# EAGLE design kicker2.2 (EAGLE 4.16)
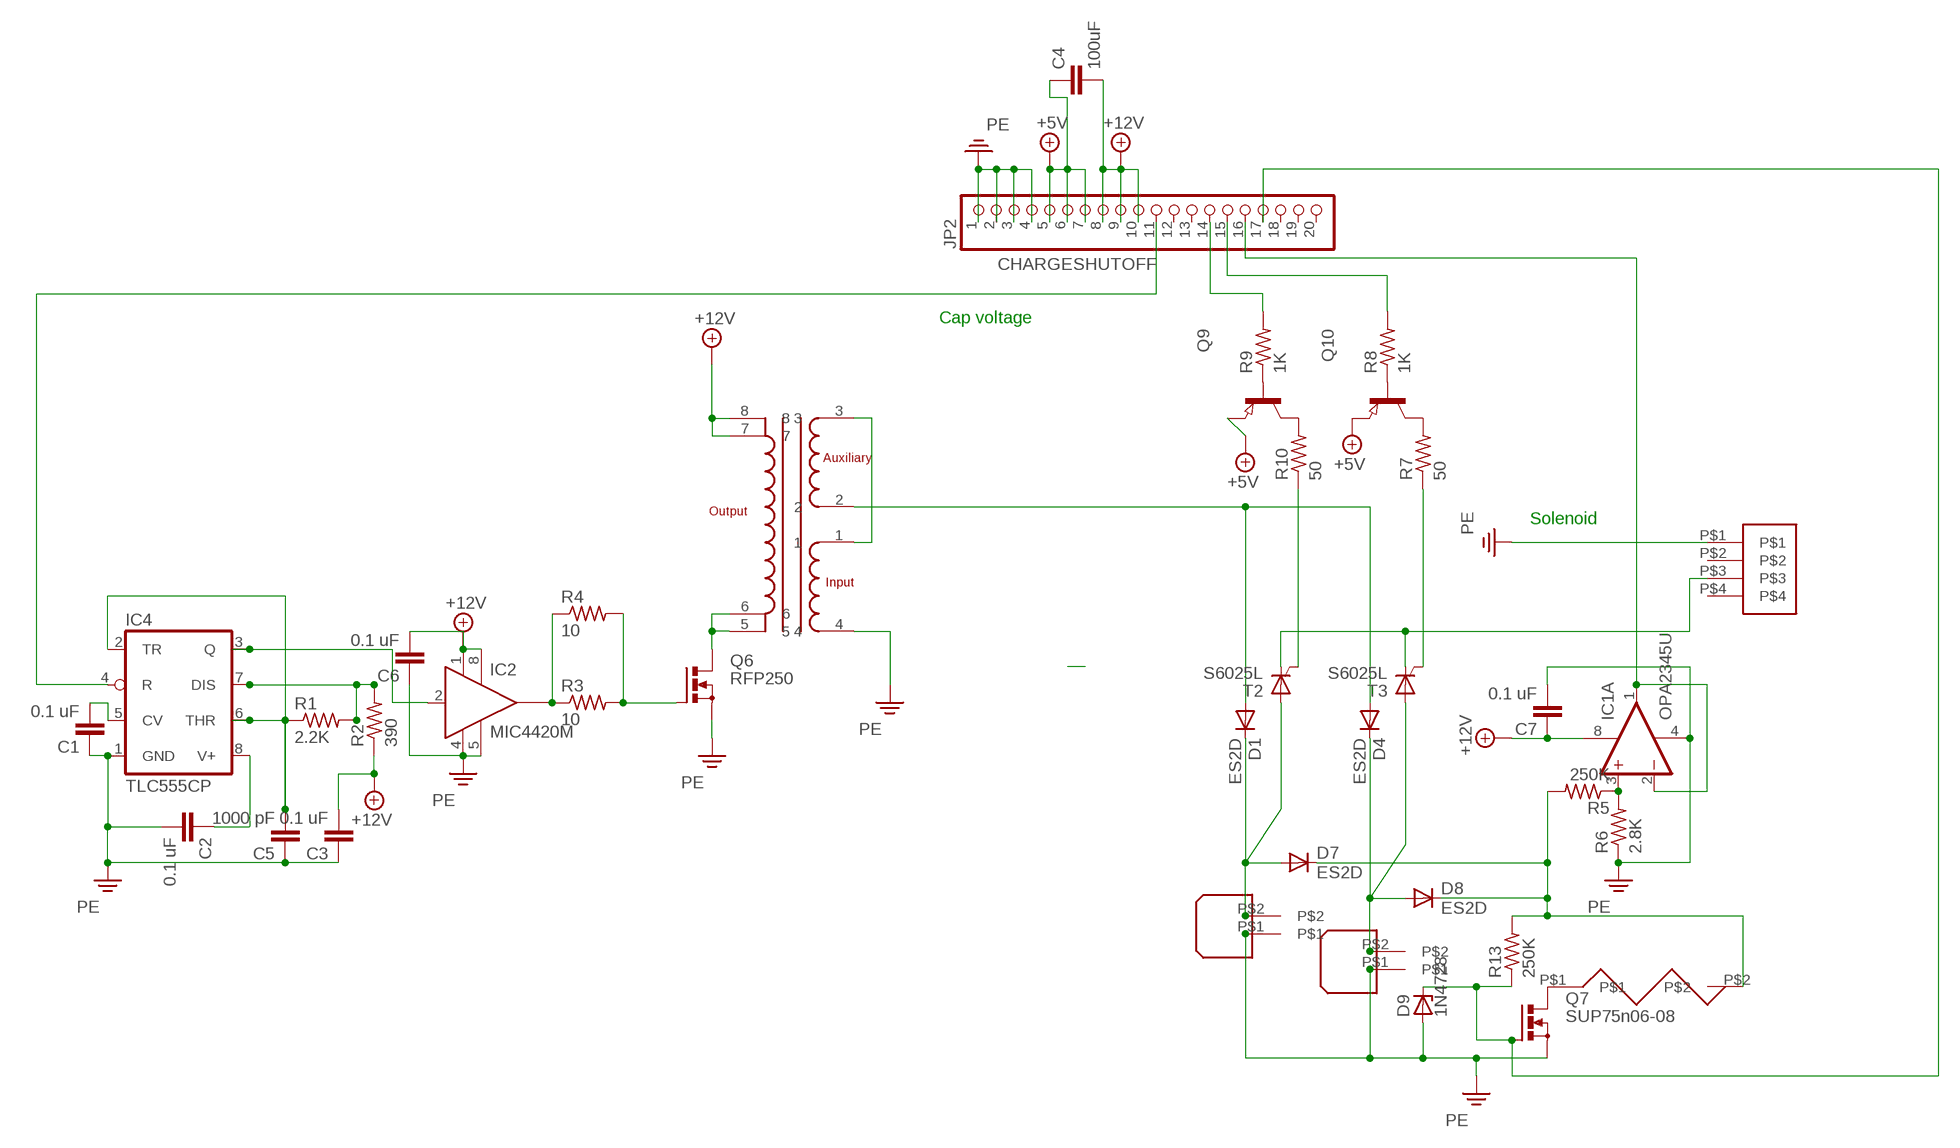
[diagram p0: schematic, sheet 1]

## Parts
C1  0.1 uF  C-EUC0805  [C0805]
C2  0.1 uF  C-EUC0805  [C0805]
C3  0.1 uF  C-EUC0805  [C0805]
C4  100uF  C-EU025-050X050  [C025-050X050]
C5  1000 pF  C-EUC0805  [C0805]
C6  0.1 uF  C-EUC0805  [C0805]
C7  0.1 uF  C-EUC0805  [C0805]
D1  ES2D  [SMB]
D4  ES2D  [SMB]
D7  ES2D  [SMB]
D8  ES2D  [SMB]
D9  1N4728  [DO41Z10]
IC1  OPA2345U  [SO08]
IC2  MIC4420M  [SO-08]
IC4  TLC555CP  LM555D  [SO08]
JP2  PINHD-1X20  [1X20]
Q6  RFP250  IRFP240  [TO247BV]
Q7  SUP75n06-08  PMOSFET_NTO220BV  [TO220BV]
Q9  PNP-TRANSISTOR_SOT23W  [SOT23W]
Q10  PNP-TRANSISTOR_SOT23W  [SOT23W]
R1  2.2K  R-US_R0805  [R0805]
R2  390  R-US_R0805  [R0805]
R3  10  R-US_R0805  [R0805]
R4  10  R-US_R0805  [R0805]
R5  250K  R-US_R0805  [R0805]
R6  2.8K  R-US_R0805  [R0805]
R7  50  R-US_R0805  [R0805]
R8  1K  R-US_R0805  [R0805]
R9  1K  R-US_R0805  [R0805]
R10  50  R-US_R0805  [R0805]
R13  250K  R-US_R0805  [R0805]
T2  S6025L  BTV58  [TO220CS]
T3  S6025L  BTV58  [TO220CS]
U$1  A0009-AL  [SM]
U$4  2PINHEADER  [2007]
U$5  2PINHEADER  [2007]
U$7  RESISTOR  [RESISTOR]
U$8  CONNECT  [CONNECT]

## Nets
+5V: C4.1 JP2.5 JP2.6 JP2.7 Q9.2(E) Q10.2(E)
+12V: C3.2 C4.2 C6.2 C7.1 IC1.8(A:V+) IC2.1(VS) IC2.8(VS1) JP2.8 JP2.9 JP2.10 R2.1 U$1.7 U$1.8
CHARGESHUTOFF: IC4.4(R) JP2.11
N$1: Q6.G R3.2 R4.2
N$2: U$1.1 U$1.3
N$4: IC2.6(OUT) R3.1 R4.1
N$5: Q6.D U$1.5 U$1.6
N$6: D1.A D4.A U$1.2
N$9: D1.C D7.A T2.A U$5.P$2
N$10: D4.C D8.A T3.A U$4.P$2
N$11: D7.C D8.C R5.2 R13.2 U$7.P$2
N$12: Q7.D U$7.P$1
N$13: R7.1 T3.G
N$16: IC1.1(A:OUT) IC1.2(A:-IN) JP2.16
N$17: IC4.7(DIS) R1.2 R2.2
N$18: C1.2 IC4.5(CV)
N$19: C2.1 IC4.8(V+)
N$20: JP2.15 R8.2
N$21: C5.2 IC4.2(TR) IC4.6(THR) R1.1
N$22: JP2.14 R9.2
N$23: IC1.3(A:+IN) R5.1 R6.2
N$24: IC2.2(IN) IC4.3(Q)
N$27: Q9.1(B) R9.1
N$28: Q9.3(C) R10.2
N$29: T2.C T3.C U$8.P$3
N$31: Q10.3(C) R7.2
N$34: Q10.1(B) R8.1
N$35: R10.1 T2.G
N$38: D9.C JP2.17 Q7.G R13.1
PE: C1.1 C2.2 C3.1 C5.1 C6.1 C7.2 D9.A IC1.4(A:V-) IC2.4(GND) IC2.5(GND1) IC4.1(GND) JP2.1 JP2.2 JP2.3 JP2.4 Q6.S Q7.S R6.1 U$1.4 U$4.P$1 U$5.P$1 U$8.P$1
Unconnected: IC1.5(B:+IN) IC1.6(B:-IN) IC1.7(B:OUT) IC2.7(OUT) JP2.12 JP2.13 JP2.18 JP2.19 JP2.20 U$8.P$2 U$8.P$4

## Notes on the sheet
- Cap voltage
- Solenoid

## Library data of the parts
C1-C7 = rcl:C-EU: CAPACITOR, European symbol
D1 D4 D7 D8 = diode:ES2D: DIODE super fast rectifier, 2 A
D9 = diode:1N4728: Z DIODE 3.3 V, 1W, 5 percent
IC1 = linear:OPA2*: Dual Operational Amplifier Low Power, Single-Supply, Rail-To-Rail Operational Amplifier Source: http://focus.ti.com/lit/ds/symlink/opa2345.pdf
IC2 = transistor-power:MIC4420: 6A-Peak Low-Side MOSFET Driver Bipolar/CMOS/DMOS Process http://www.micrel.com/_PDF/mic4420.pdf
IC4 = linear:*555: TIMER
JP2 = pinhead:PINHD-1X20: PIN HEADER
Q6 = transistor-power:IRFP240: HEXFET Power MosFet Source: http://www.irf.com/
Q7 = transistor-power:PMOSFET_N: Power MOSFET N-Channel
Q9 Q10 = semicon-smd-ipc:PNP-TRANSISTOR_: PNP TRANSISTOR
R1-R10 R13 = rcl:R-US_: RESISTOR, American symbol
T2 T3 = triac:BTV58: THYRISTOR
U$1 = Kicker:A0009-AL
U$4 U$5 = kickerHeader:2PINHEADER
U$7 = kickerHeader:RESISTOR
U$8 = 19inch:CONNECT

## Board
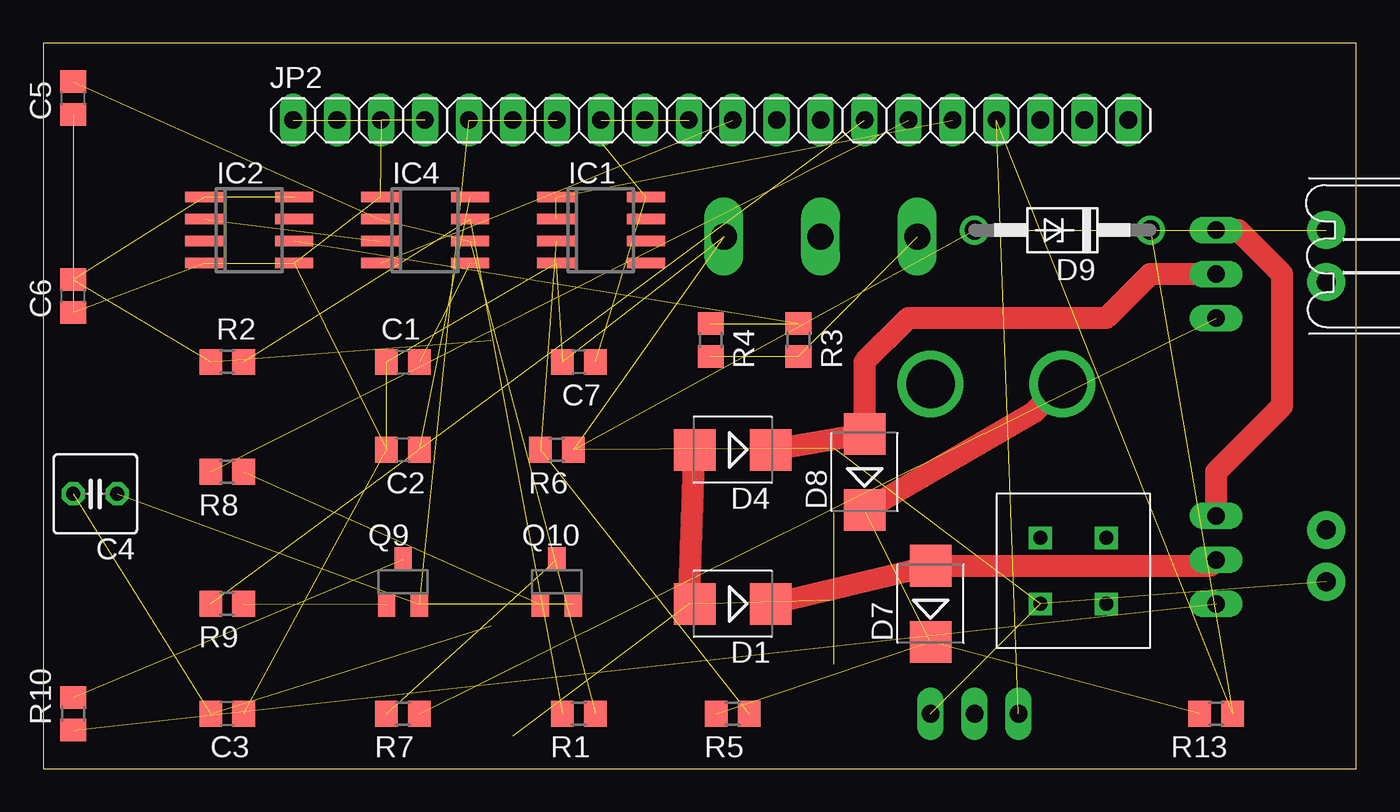
[diagram p1: board, top side]
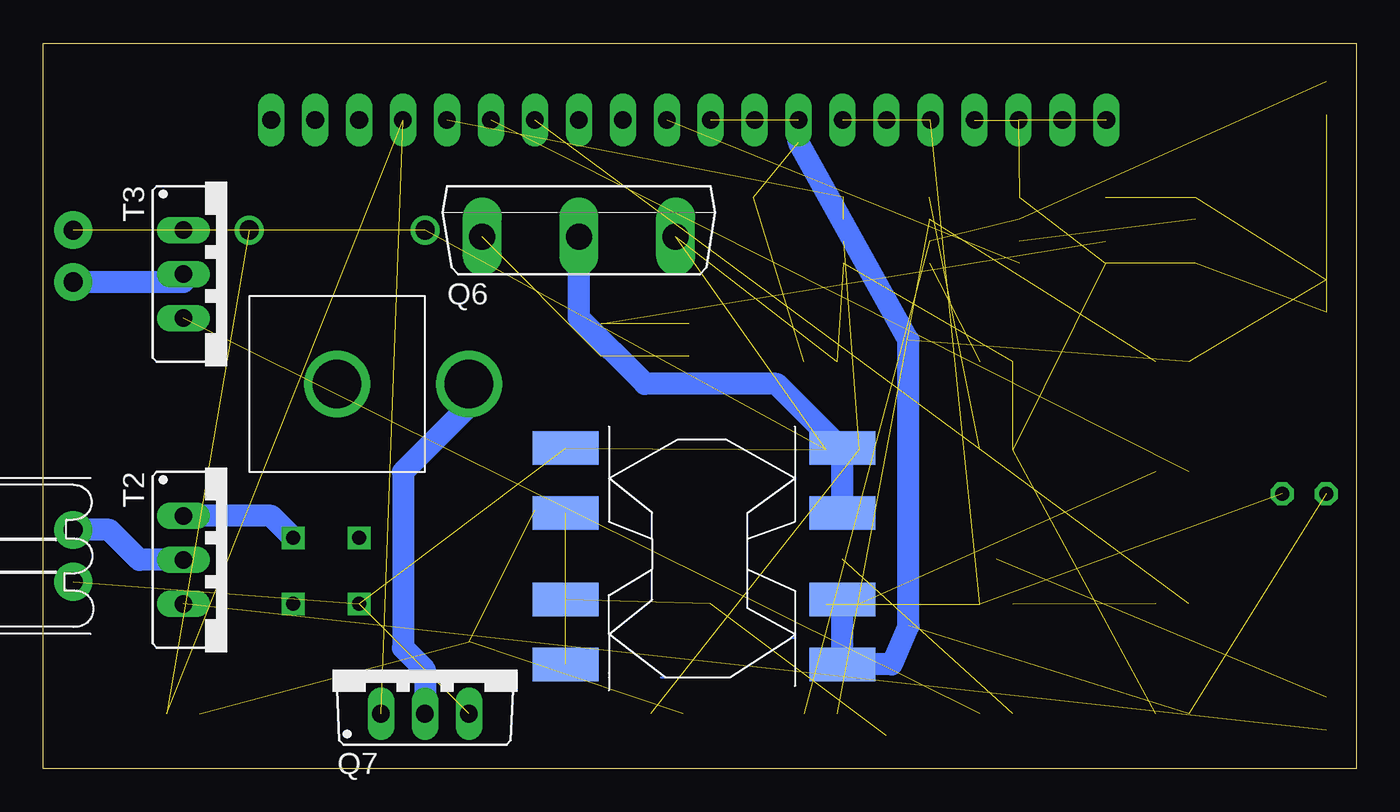
[diagram p2: board, bottom side, seen from below]

Size 75.87 x 41.9 mm. Coordinates in mm from the lower left corner, seen from the top.
Outline: 0,0 75.87,0 75.87,41.9 0,41.9 0,0
Copper layers (1*16): Top 0.035mm / dielectric 1.5mm / Bottom 0.035mm
Design rules "default": minimum track width 10mil, minimum drill 24mil, track to track 8mil, track to pad 8mil, pad to pad 8mil, via to via 8mil, smd to smd 8mil, copper to edge 40mil, drill to drill 8mil, minimum pad ring 10mil, minimum via ring 8mil, stop-mask expansion 4mil, vias tented up to drill 0mil, thermal gap 10mil

### Footprints (pad centres in the part's own frame; a part is rotated, then mirrored left to right if it is on the bottom)
C0805 = smd 1.3 x 1.5: 1 -0.95,0; 2 0.95,0
C025-050X050 = drill 0.813 octagon: 1 -1.27,0; 2 1.27,0
SMB = smd 2.4 x 2.4: A 2.2,0; C -2.2,0
DO41Z10 = drill 1.118 round: A 5.08,0; C -5.08,0
SO08 = smd 0.6 x 2.2: 1 -1.905,-2.6; 2 -0.635,-2.6; 3 0.635,-2.6; 4 1.905,-2.6; 5 1.905,2.6; 6 0.635,2.6; 7 -0.635,2.6; 8 -1.905,2.6
SO-08 = smd 0.6 x 2.2: 1 -1.905,-2.6; 2 -0.635,-2.6; 3 0.635,-2.6; 4 1.905,-2.6; 5 1.905,2.6; 6 0.635,2.6; 7 -0.635,2.6; 8 -1.905,2.6
1X20 = drill 1.016 long: 1 -24.13,0; 2 -21.59,0; 3 -19.05,0; 4 -16.51,0; 5 -13.97,0; 6 -11.43,0; 7 -8.89,0; 8 -6.35,0; 9 -3.81,0; 10 -1.27,0; 11 1.27,0; 12 3.81,0; 13 6.35,0; 14 8.89,0; 15 11.43,0; 16 13.97,0; 17 16.51,0; 18 19.05,0; 19 21.59,0; 20 24.13,0
TO247BV = drill 1.499 long: D 0,-2.921; G -5.588,-2.921; S 5.588,-2.921
TO220BV = drill 1.016 long: D 0,-2.54; G -2.54,-2.54; S 2.54,-2.54
SOT23W = smd 1 x 1.4: 1 -0.95,-1.303; 2 0.95,-1.303; 3 0,1.303
R0805 = smd 1.3 x 1.5: 1 -0.95,0; 2 0.95,0
TO220CS = drill 1.016 long: A 0,-2.54; C -2.54,-2.54; G 2.54,-2.54
SM = smd 3.81 x 1.93: 1 0.5,-3.5; 2 0.5,0.25; 3 0.5,5.25; 4 0.5,9; 5 16.5,9; 6 16.5,5.25; 7 16.5,0.25; 8 16.5,-3.5
2007 = drill 1.1 pad 2.184 round: P$1 0,0; P$2 3,0
RESISTOR = drill 2.8 round: P$1 -2.54,0; P$2 5.08,0
CONNECT = drill 0.8 square: P$1 2.54,2.54; P$2 6.35,2.54; P$3 6.35,6.35; P$4 2.54,6.35

### Placement (x,y rotation side)
C1  20.79,23.49 0 top
C2  20.79,18.41 180 top
C3  10.63,3.17 180 top
C4  3.01,15.87 180 top
C5  1.74,38.73 90 top
C6  1.74,27.3 90 top
C7  30.95,23.49 180 top
D1  39.84,9.52 180 top
D4  39.84,18.41 180 top
D7  51.27,9.52 90 top
D8  47.46,17.14 90 top
D9  58.89,31.11 180 top
IC1  32.22,31.11 270 top
IC2  11.9,31.11 270 top
IC4  22.06,31.11 270 top
JP2  38.57,37.46 0 top
Q6  44.92,33.65 0 bottom
Q7  53.81,5.71 0 bottom
Q9  20.79,10.79 0 top
Q10  29.68,10.79 0 top
R1  30.95,3.17 180 top
R2  10.63,23.49 0 top
R3  43.65,24.76 270 top
R4  38.57,24.76 270 top
R5  39.84,3.17 180 top
R6  29.68,18.41 180 top
R7  20.79,3.17 180 top
R8  10.63,17.14 180 top
R9  10.63,9.52 180 top
R10  1.74,3.17 90 top
R13  67.78,3.17 180 top
T2  65.24,12.06 270 bottom
T3  65.24,28.57 270 bottom
U$1  46.19,9.52 0 bottom
U$4  74.13,31.11 270 top
U$5  74.13,10.79 90 bottom
U$7  53.81,22.22 180 bottom
U$8  55.08,6.98 0 top

### Tracks (layer width: path | path; a pad name or v marks a point on that pad's centre or on a via)
+5V  (5 unrouted)
+12V  (10 unrouted)
  Bottom 1.27: U$1.7 29.69,9.53 29.68,9.52 29.69,9.51 U$1.8 26.83,6.02 25.87,8.25 25.87,24.76 32.22,36.19 JP2.8
CHARGESHUTOFF  (1 unrouted)
N$1  (2 unrouted)
N$2  (1 unrouted)
N$4  (2 unrouted)
N$5
  Bottom 1.27: U$1.6 29.69,14.61 | 29.69,14.61 29.69,18.42 | 29.69,14.61 29.68,14.6 | Q6.D 44.92,26.03 41.11,22.22 33.49,22.22 29.69,18.42 | 29.69,18.42 29.68,18.41 | U$1.5 29.69,18.42
N$6  (2 unrouted)
  Top 1.27: D4.A 37.3,9.52 D1.A
N$9
  Top 1.27: D1.C D7.A 67.44,11.72 T2.A
  Bottom 1.27: U$5.P$2 72.05,13.79 70.32,12.06 T2.A
N$10
  Top 1.27: D4.C D8.A 47.46,23.49 50,26.03 61.43,26.03 63.97,28.57 T3.A
  Bottom 1.27: U$4.P$2 67.78,28.11 T3.A
N$11  (3 unrouted)
  Top 1.27: D8.C 57.28,20.61 U$7.P$2
N$12
  Bottom 1.27: U$7.P$1 51.27,20.95 55.08,17.14 55.08,6.98 53.81,5.71 Q7.D
N$13  (1 unrouted)
N$16  (2 unrouted)
N$17  (2 unrouted)
N$18  (1 unrouted)
N$19  (1 unrouted)
N$20  (1 unrouted)
N$21  (3 unrouted)
N$22  (1 unrouted)
N$23  (2 unrouted)
N$24  (1 unrouted)
N$27  (1 unrouted)
N$28  (1 unrouted)
N$29
  Top 1.27: T2.C 67.78,17.14 71.59,20.95 71.59,28.57 69.05,31.11 T3.C
  Bottom 1.27: T2.C 62.7,14.6 U$8.P$3
N$31  (1 unrouted)
N$34  (1 unrouted)
N$35  (1 unrouted)
N$38  (3 unrouted)
PE  (21 unrouted)